# EAGLE schematic SabotSchematicParticle (EAGLE 9.4.2)
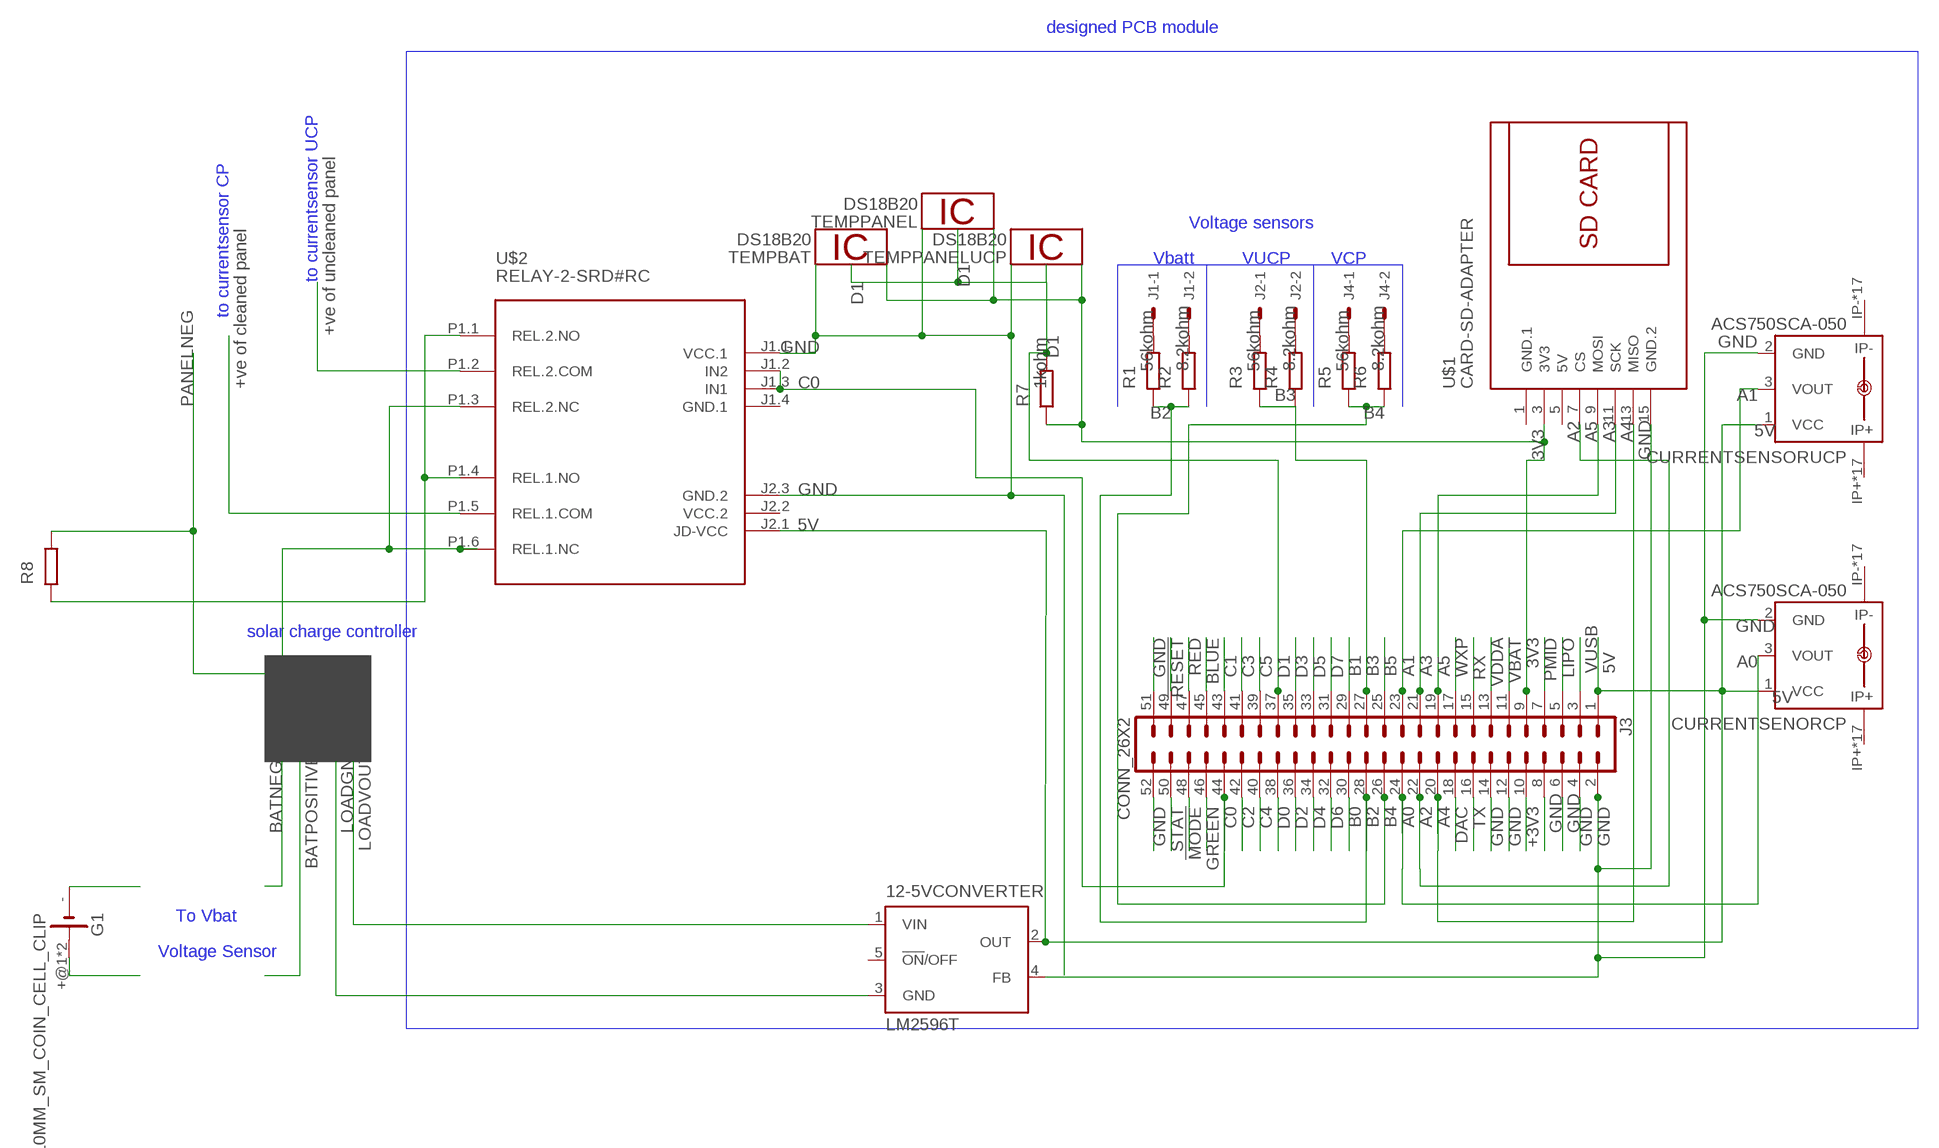
[diagram p0: schematic, sheet 1]

## Parts
12-5VCONVERTER  LM2596T  [T05D]
CURRENTSENORCP  ACS750SCA-050  [ACS75050]
CURRENTSENSORUCP  ACS750SCA-050  [ACS75050]
G1  10MM_SM_COIN_CELL_CLIP  [10MM_SM_COIN_CELL_CLIP]
J1  22-27-2021-02  [6410-02]
J2  22-27-2021-02  [6410-02]
J3  CONN_26X2  [2X26]
J4  22-27-2021-02  [6410-02]
R1  R  (no package)
R2  R  (no package)
R3  R  (no package)
R4  R  (no package)
R5  R  (no package)
R6  R  (no package)
R7  R  (no package)
R8  R  (no package)
TEMPBAT  DS18B20  [TO92-]
TEMPPANEL  DS18B20  [TO92-]
TEMPPANELUCP  DS18B20  [TO92-]
U$1  CARD-SD-ADAPTER  [CARD-SD-ADAPTER]
U$2  RELAY-2-SRD#RC  [RELAY-2-SRD#RC]

## Nets
3V3: J3.9 R7.1 U$1.3(3V3)
5V [VIN]: 12-5VCONVERTER.2(OUT) CURRENTSENORCP.1(VCC) CURRENTSENSORUCP.1(VCC) J3.1 U$2.J2.1(JD-VCC)
!MODE: J3.48
!RESET: J3.49
+3V3 [3V3]: J3.10
A0: CURRENTSENORCP.3(VOUT) J3.24
A1: CURRENTSENSORUCP.3(VOUT) J3.23
A2: J3.22 U$1.7(CS)
A3: J3.21 U$1.11(SCK)
A4: J3.20 U$1.13(MISO)
A5: J3.19 U$1.9(MOSI)
B0: J3.30
B1: J3.29
B2: J3.28 R1.1 R2.1
B3: J3.27 R3.1 R4.1
B4: J3.26 R5.1 R6.1
B5: J3.25
BLUE: J3.45
C0: J3.44 U$2.J1.2(IN2) U$2.J1.3(IN1)
C1: J3.43
C2: J3.42
C3: J3.41
C4: J3.40
C5: J3.39
D0: J3.38
D1: J3.37 R7.2
D2: J3.36
D3: J3.35
D4: J3.34
D5: J3.33
D6: J3.32
D7: J3.31
DAC: J3.18
GND: 12-5VCONVERTER.4(FB) CURRENTSENORCP.2(GND) CURRENTSENSORUCP.2(GND) J3.2 J3.4 J3.6 J3.8 J3.12 J3.14 J3.51 J3.52 U$1.15(GND.2) U$2.J1.1(VCC.1) U$2.J2.3(GND.2)
GREEN: J3.46
LIPO [LIPO]: J3.5
LOADGND: 12-5VCONVERTER.3(GND)
LOADVOUT: 12-5VCONVERTER.1(VIN)
N$1: U$2.P1.2(REL.2.COM)
N$2: U$2.P1.5(REL.1.COM)
N$3: U$2.P1.3(REL.2.NC) U$2.P1.6(REL.1.NC)
N$4: R8.1 U$2.P1.1(REL.2.NO) U$2.P1.4(REL.1.NO)
N$5: J1.1 R1.2
N$6: J1.2 R2.2
N$7: J2.1 R3.2
N$8: J2.2 R4.2
N$9: J4.1 R5.2
N$10: J4.2 R6.2
N$11: G1.-
N$12: G1.+@1(+) G1.+@2(+)
PANELNEG: R8.2
PMID [PMID]: J3.7
RED: J3.47
RX: J3.15
STAT: J3.50
TX: J3.16
VBAT: J3.11
VDDA: J3.13
VUSB: J3.3
WXP: J3.17
Unconnected: 12-5VCONVERTER.5(!ON!/OFF) CURRENTSENORCP.IP+ CURRENTSENORCP.IP+@2(IP+) CURRENTSENORCP.IP+@3(IP+) CURRENTSENORCP.IP+@4(IP+) CURRENTSENORCP.IP+@5(IP+) CURRENTSENORCP.IP+@6(IP+) CURRENTSENORCP.IP+@7(IP+) CURRENTSENORCP.IP+@8(IP+) CURRENTSENORCP.IP+@9(IP+) CURRENTSENORCP.IP+@10(IP+) CURRENTSENORCP.IP+@11(IP+) CURRENTSENORCP.IP+@12(IP+) CURRENTSENORCP.IP+@13(IP+) CURRENTSENORCP.IP+@14(IP+) CURRENTSENORCP.IP+@15(IP+) CURRENTSENORCP.IP+@16(IP+) CURRENTSENORCP.IP+@17(IP+) CURRENTSENORCP.IP- CURRENTSENORCP.IP-@2(IP-) CURRENTSENORCP.IP-@3(IP-) CURRENTSENORCP.IP-@4(IP-) CURRENTSENORCP.IP-@5(IP-) CURRENTSENORCP.IP-@6(IP-) CURRENTSENORCP.IP-@7(IP-) CURRENTSENORCP.IP-@8(IP-) CURRENTSENORCP.IP-@9(IP-) CURRENTSENORCP.IP-@10(IP-) CURRENTSENORCP.IP-@11(IP-) CURRENTSENORCP.IP-@12(IP-) CURRENTSENORCP.IP-@13(IP-) CURRENTSENORCP.IP-@14(IP-) CURRENTSENORCP.IP-@15(IP-) CURRENTSENORCP.IP-@16(IP-) CURRENTSENORCP.IP-@17(IP-) CURRENTSENSORUCP.IP+ CURRENTSENSORUCP.IP+@2(IP+) CURRENTSENSORUCP.IP+@3(IP+) CURRENTSENSORUCP.IP+@4(IP+) CURRENTSENSORUCP.IP+@5(IP+) CURRENTSENSORUCP.IP+@6(IP+) CURRENTSENSORUCP.IP+@7(IP+) CURRENTSENSORUCP.IP+@8(IP+) CURRENTSENSORUCP.IP+@9(IP+) CURRENTSENSORUCP.IP+@10(IP+) CURRENTSENSORUCP.IP+@11(IP+) CURRENTSENSORUCP.IP+@12(IP+) CURRENTSENSORUCP.IP+@13(IP+) CURRENTSENSORUCP.IP+@14(IP+) CURRENTSENSORUCP.IP+@15(IP+) CURRENTSENSORUCP.IP+@16(IP+) CURRENTSENSORUCP.IP+@17(IP+) CURRENTSENSORUCP.IP- CURRENTSENSORUCP.IP-@2(IP-) CURRENTSENSORUCP.IP-@3(IP-) CURRENTSENSORUCP.IP-@4(IP-) CURRENTSENSORUCP.IP-@5(IP-) CURRENTSENSORUCP.IP-@6(IP-) CURRENTSENSORUCP.IP-@7(IP-) CURRENTSENSORUCP.IP-@8(IP-) CURRENTSENSORUCP.IP-@9(IP-) CURRENTSENSORUCP.IP-@10(IP-) CURRENTSENSORUCP.IP-@11(IP-) CURRENTSENSORUCP.IP-@12(IP-) CURRENTSENSORUCP.IP-@13(IP-) CURRENTSENSORUCP.IP-@14(IP-) CURRENTSENSORUCP.IP-@15(IP-) CURRENTSENSORUCP.IP-@16(IP-) CURRENTSENSORUCP.IP-@17(IP-)

## Notes on the sheet
- designed PCB module
- Voltage sensors
- Vbatt | VUCP | VCP
- to currentsensor UCP
- to currentsensor CP
- +ve of uncleaned panel
- +ve of cleaned panel
- solar charge controller
- To Vbat
- Voltage Sensor

## Power pins joined to a net without a drawn wire
1W: TEMPBAT.2 TEMPPANEL.2 TEMPPANELUCP.2
5V: U$1.5(5V)
GND: TEMPBAT.1 TEMPPANEL.1 TEMPPANELUCP.1
GND.1: U$1.1(GND.1) U$2.J1.4(GND.1)
VCC.2: U$2.J2.2(VCC.2)
VDD: TEMPBAT.3 TEMPPANEL.3 TEMPPANELUCP.3

## Library data of the parts
12-5VCONVERTER = national-semiconductor:LM2596: SIMPLE SWITCHER® Power Converter 150 kHz 3A Step-Down Voltage Regulator Source: http://www.national.com/ds/LM/LM2596.pdf; MPN: LM2596T-ADJ/LF02; OC_FARNELL: 9494162; OC_NEWARK: 65K5910
CURRENTSENORCP CURRENTSENSORUCP = allegro:ACS750*CA-050: Current Sensor display layer 49 Reference in BRD and place VIAs on circles Source: www.allegromicro.com/datafile/0750-050.pdf; MF: ALLEGRO MICROSYSTEMS, INC.; MPN: ACS750SCA-050; OC_FARNELL: 1457175; OC_NEWARK: 81H6588
G1 = battery:10MM_SM_COIN_CELL_CLIP: Battery cell clip for CR927 Source: KEYSTONE ELECTRONICS CORP. www.keyelco.com, ASTORIA, N.Y. 11105-2017 PART ANME 10mm SM COIN CELl CLIP DWG NO. 3030
J1 J2 J4 = con-molex:22-?-02: CONNECTOR wire to board 2.54 mm (.1 inch) pitch header; MF: MOLEX; OC_FARNELL: unknown; OC_NEWARK: unknown
J3 = SparkFun-Connectors:CONN_26X2: Multi connection point. Often used as Generic Header-pin footprint for 0.1 inch spaced/style header connections On any of the 0.1 inch spaced packages, you can populate with these: Break Away Headers - Straight <https://www.sparkfun.com/products/116> (PRT-00116) Break Away Male Headers - Right Angle <https://www.sparkfun.com/products/553> (PRT-00553) Female Headers <https://www.sparkfun.com/products/115> (PRT-00115) Break Away Headers - Machine Pin <https://www.sparkfun.com/products/117> (PRT-00117) Break Away Female Headers - Swiss Machine Pin <https://www.sparkfun.com/products/743> (PRT-00743)
R1 R3 R5 = ngspice-simulation:R: RESISTOR; _EXTERNAL_: 56kohm
R2 R4 R6 = ngspice-simulation:R: RESISTOR; _EXTERNAL_: 8.2kohm
R7 = ngspice-simulation:R: RESISTOR; _EXTERNAL_: 1kohm
R8 = ngspice-simulation:R: RESISTOR
TEMPBAT TEMPPANEL TEMPPANELUCP = 1wire:DS18B20: Programmable Resolution Digital Thermometer This chip provides a onewire thermosensor with approx. 0.5°C accuracy. A programmable over/undertemperure alarm is available. The precision can be set from 9..12 bits. Notes: Vdd must be applied for accurate measurements at low temperatures, as the parasite power circuit otherwise heats the sensor. If parasite power is used, Vdd has to be connected to GND. The DS1822 is a low-cost thermometer chip, the DS18S20 is similar to the DS18B20, but with 9 Bit precision only. Author: Jan Kandziora <jjj@gmx.de>
U$1 = diy-modules:CARD-SD-ADAPTER: Full Size SD Card Adapter Module with onboard 3.3V regulator Guide describing how to use SD card with Arduino is available here: https://www.arduino.cc/en/Reference/SDCardNotes Click here to find device on ebay.com <http://www.ebay.com/sch/sd+card+socket+module>
U$2 = diy-modules:RELAY-2-SRD#RC: 2-Channel Relay Module based on SRD-05VDC-SL-C relays Symbol with relays pins Click here to find device on ebay.com <http://www.ebay.com/sch/two+channel+relay+module+optocoupler+5v>

## Net classes
3 VIN: width 0.305 mm, clearance 0.508 mm
4 3V3: width 0.305 mm, clearance 0.508 mm
6 LIPO: width 0.305 mm, clearance 0.508 mm
7 PMID: width 0.305 mm, clearance 0.508 mm